# EAGLE design 12-5 (EAGLE 5.10)
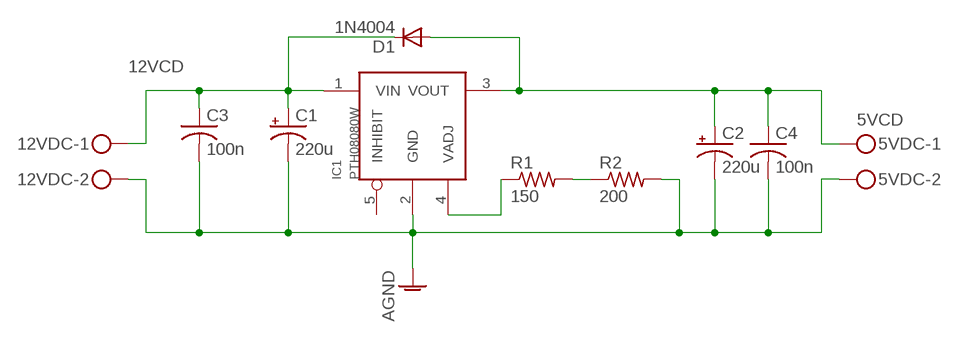
[diagram p0: schematic, sheet 1]

## Parts
5VDC  MKDSN1,5/2-5,08  [MKDSN1,5/2-5,08]
12VDC  MKDSN1,5/2-5,08  [MKDSN1,5/2-5,08]
C1  220u  CPOL-USE2.5-5  [E2,5-5]
C2  220u  CPOL-USE2.5-5  [E2,5-5]
C3  100n  C-US025-025X050  [C025-025X050]
C4  100n  C-US025-025X050  [C025-025X050]
D1  1N4004  [DO41-10]
IC1  PTH08080W  [PLACA_XTEND_RF]
R1  150  R-US_M1206  [M1206]
R2  200  R-US_M1206  [M1206]

## Nets
5VCD: 5VDC.1 C2.+ C4.1 D1.A IC1.3(VOUT)
12VCD: 12VDC.1 C1.+ C3.1 D1.C IC1.1(VIN)
AGND: 5VDC.2 12VDC.2 C1.- C2.- C3.2 C4.2 IC1.2(GND) R2.2
N$11: IC1.4(VADJ) R1.1
N$12: R1.2 R2.1
Unconnected: IC1.5(INHIBIT)

## Library data of the parts
5VDC 12VDC = con-phoenix-508:MKDSN1,5/2-5,08: MKDSN 1,5/ 2-5,08 Printklemme Nennstrom: 13,5 A Nennspannung: 250 V Rastermaß: 5,08 mm Polzahl: 2 Anschlussart: Schraubanschluss Montage: Löten Anschlussrichtung Leiter/Platine: 0 ° Artikelnummer: 1729128 Source: http://eshop.phoenixcontact.com .. 1729128.pdf
C1 C2 = rcl:CPOL-US: POLARIZED CAPACITOR, American symbol
C3 C4 = rcl:C-US: CAPACITOR, American symbol
D1 = diode:1N4004: DIODE general purpose rectifier, 1 A
IC1 = cornejoso:PTH08080W
R1 R2 = rcl:R-US_: RESISTOR, American symbol

## Board
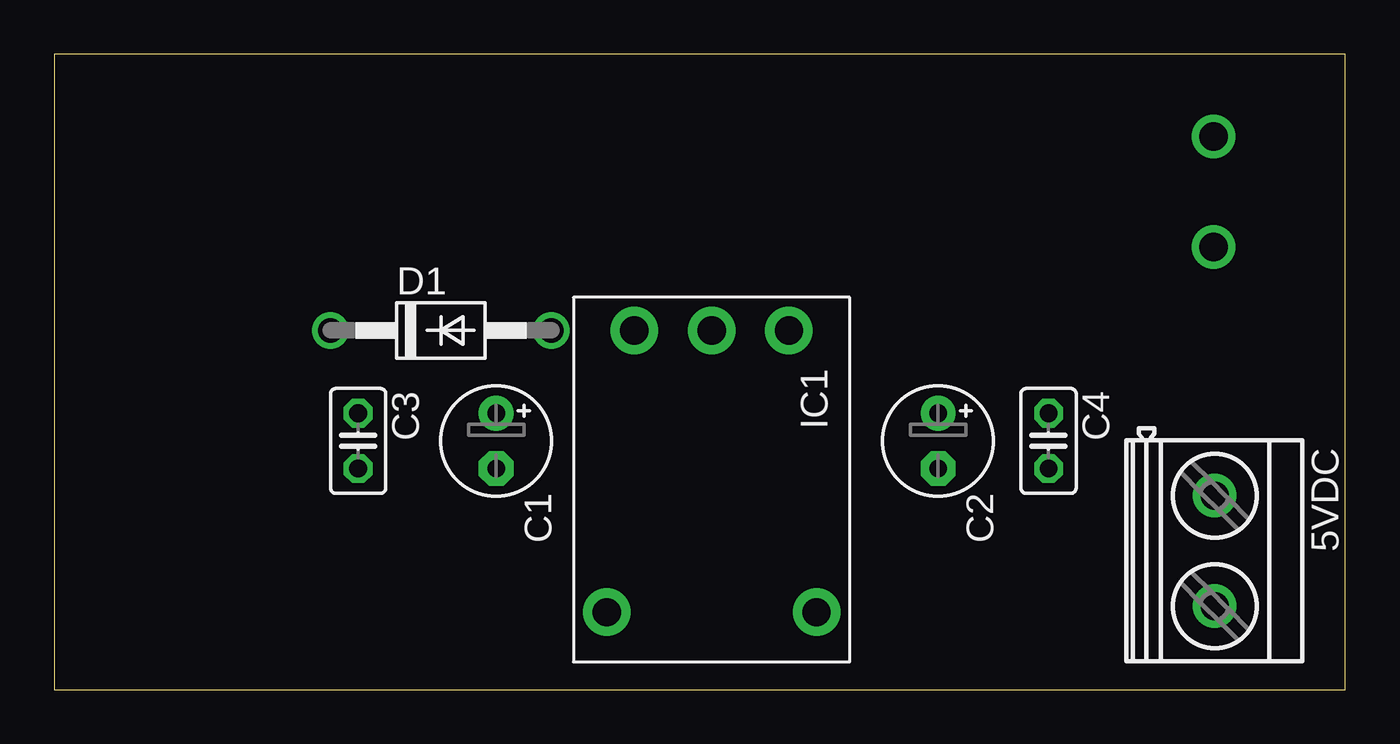
[diagram p1: board, top side]
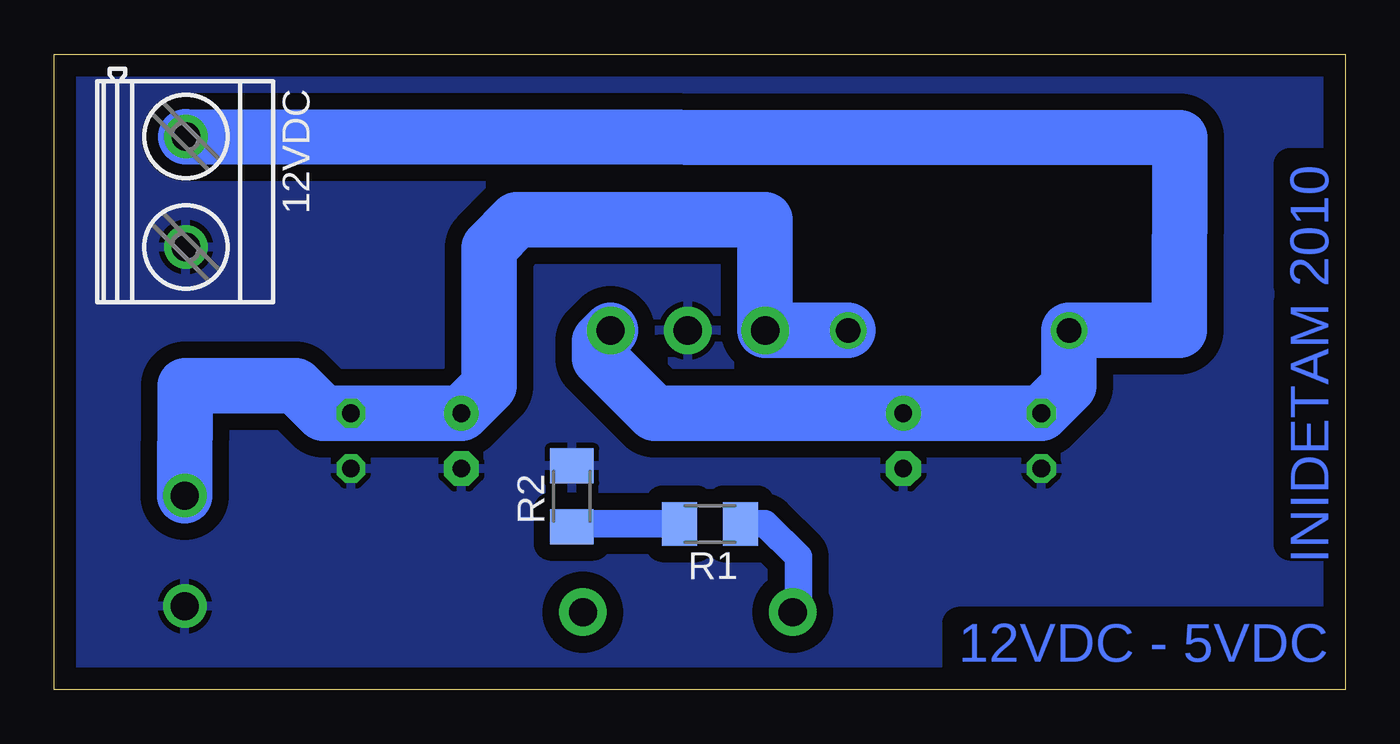
[diagram p2: board, bottom side, seen from below]

Size 59.36 x 29.2 mm. Coordinates in mm from the lower left corner, seen from the top.
Outline: 0,0 59.36,0 59.36,29.2 0,29.2 0,0
Copper layers (1*16): Top 0.035mm / dielectric 1.5mm / Bottom 0.035mm
Design rules "default *": minimum track width 10mil, minimum drill 24mil, track to track 30mil, track to pad 30mil, pad to pad 8mil, via to via 8mil, smd to smd 8mil, copper to edge 40mil, drill to drill 8mil, minimum pad ring 10mil, minimum via ring 8mil, stop-mask expansion 4mil, vias tented up to drill 0mil, thermal gap 10mil

### Footprints (pad centres in the part's own frame; a part is rotated, then mirrored left to right if it is on the bottom)
MKDSN1,5/2-5,08 = drill 1.3 pad 2 round: 1 -2.561,0.025; 2 2.519,0.025
E2,5-5 = drill 0.813 pad 1.6 round: + -1.27,0 | drill 0.813 pad 1.6 octagon: - 1.27,0
C025-025X050 = drill 0.813 octagon: 1 -1.27,0; 2 1.27,0
DO41-10 = drill 1.118 round: A 5.08,0; C -5.08,0
PLACA_XTEND_RF = drill 1.3 pad 2.184 round: 1 0,7.112; 2 0,3.556; 3 0,0; 4 12.954,-1.27; 5 12.954,8.382
M1206 = smd 1.6 x 2: 1 -1.4,0; 2 1.4,0

### Placement (x,y rotation side)
5VDC  53.34,6.35 270 top
12VDC  53.34,22.86 270 bottom
C1  20.32,11.43 270 top
C2  40.64,11.43 270 top
C3  13.97,11.43 270 top
C4  45.72,11.43 270 top
D1  17.78,16.51 0 top
IC1  26.67,16.51 270 top
R1  29.21,7.62 180 bottom
R2  35.56,8.89 90 bottom

### Tracks (layer width: path | path; a pad name or v marks a point on that pad's centre or on a via)
5VCD
  Bottom 2.54: 5VDC.1 53.34,13.97 48.26,13.97 46.99,12.7 C4.1 C2.+ 39.37,13.97 39.37,20.32 38.1,21.59 26.67,21.59 IC1.3 D1.A
12VCD
  Bottom 2.54: 12VDC.1 7.59,25.38 7.62,16.51 D1.C 12.7,13.97 C3.1 C1.+ 31.75,12.7 34.29,15.24 34.29,16 IC1.1
AGND
  pour Bottom: 0,0 0,29.21 59.69,29.21 59.69,0
N$11
  Bottom 1.27: IC1.4 25.15,3.81 25.15,6.1 26.67,7.62 R1.1
N$12
  Bottom 0.254: R1.2 30.48,7.62
  Bottom 1.27: R1.2 35.43,7.62 R2.1

### Text on the board
Bottom: 2010 | INIDETAM | 12VDC - 5VDC